# Altium schematic sheet MSPBreakout.SchDoc
size Letter
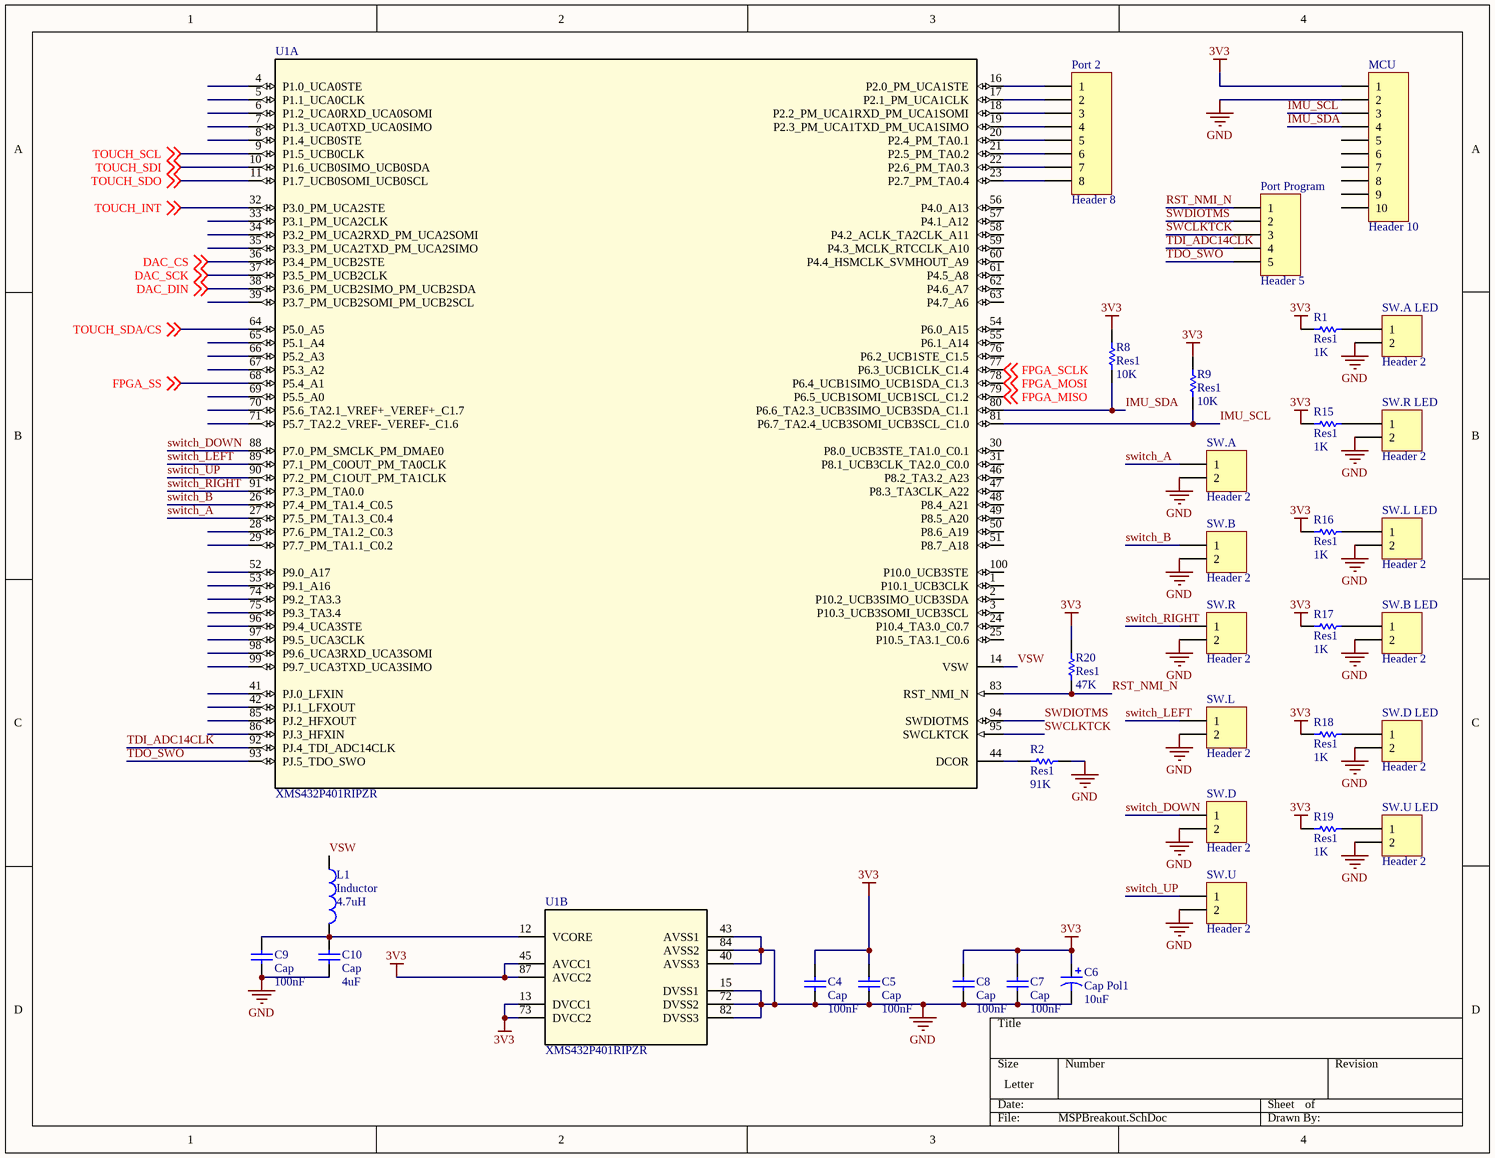
[diagram p0: MSPBreakout.SchDoc]

## Parts
C4  Cap  value 100nF  [6-0805_M]
C5  Cap  value 100nF  [6-0805_M]
C6  Cap Pol1  value 10uF  [6-0805_M]
C7  Cap  value 100nF  [6-0805_M]
C8  Cap  value 100nF  [6-0805_M]
C9  Cap  value 100nF  [6-0805_M]
C10  Cap  value 4uF  [6-0805_M]
L1  Inductor  value 4.7uH  [AXIAL-0.3]
MCU  Header 10  [HDR1X10]
Port_2  Header 8  [HDR1X8]
Port_Program  Header 5  [HDR1X5]
R1  Res1  value 1K  [6-0805_M]
R2  Res1  value 91K  [6-0805_M]
R8  Res1  value 10K  [6-0805_M]
R9  Res1  value 10K  [6-0805_M]
R15  Res1  value 1K  [6-0805_M]
R16  Res1  value 1K  [6-0805_M]
R17  Res1  value 1K  [6-0805_M]
R18  Res1  value 1K  [6-0805_M]
R19  Res1  value 1K  [6-0805_M]
R20  Res1  value 47K  [6-0805_M]
SW.A  Header 2  [HDR1X2]
SW.A_LED  Header 2  [HDR1X2]
SW.B  Header 2  [HDR1X2]
SW.B_LED  Header 2  [HDR1X2]
SW.D  Header 2  [HDR1X2]
SW.D_LED  Header 2  [HDR1X2]
SW.L  Header 2  [HDR1X2]
SW.L_LED  Header 2  [HDR1X2]
SW.R  Header 2  [HDR1X2]
SW.R_LED  Header 2  [HDR1X2]
SW.U  Header 2  [HDR1X2]
SW.U_LED  Header 2  [HDR1X2]
U1  XMS432P401RIPZR  [PZ0100A_M]  (parts A,B of 2)

## Nets
3V3: C4.2 C5.2 C6.1 C7.2 C8.2 MCU.1 R1.1 R8.2 R9.2 R15.1 R16.1 R17.1 R18.1 R19.1 R20.2 U1.13(DVCC1) U1.45(AVCC1) U1.73(DVCC2) U1.87(AVCC2)
GND: C4.1 C5.1 C6.2 C7.1 C8.1 C9.1 C10.1 MCU.2 R2.2 SW.A.2 SW.A_LED.2 SW.B.2 SW.B_LED.2 SW.D.2 SW.D_LED.2 SW.L.2 SW.L_LED.2 SW.R.2 SW.R_LED.2 SW.U.2 SW.U_LED.2 U1.15(DVSS1) U1.40(AVSS3) U1.43(AVSS1) U1.72(DVSS2) U1.82(DVSS3) U1.84(AVSS2)
DAC_CS: U1.36(P3.4_PM_UCB2STE) ; off-sheet DAC_CS
DAC_DIN: U1.38(P3.6_PM_UCB2SIMO_PM_UCB2SDA) ; off-sheet DAC_DIN
DAC_SCK: U1.37(P3.5_PM_UCB2CLK) ; off-sheet DAC_SCK
FPGA_MISO: U1.79(P6.5_UCB1SOMI_UCB1SCL_C1.2) ; off-sheet FPGA_MISO
FPGA_MOSI: U1.78(P6.4_UCB1SIMO_UCB1SDA_C1.3) ; off-sheet FPGA_MOSI
FPGA_SCLK: U1.77(P6.3_UCB1CLK_C1.4) ; off-sheet FPGA_SCLK
FPGA_SS: U1.68(P5.4_A1) ; off-sheet FPGA_SS
IMU_SCL: MCU.3 R9.1 U1.81(P6.7_TA2.4_UCB3SOMI_UCB3SCL_C1.0)
IMU_SDA: MCU.4 R8.1 U1.80(P6.6_TA2.3_UCB3SIMO_UCB3SDA_C1.1)
RST_NMI_N: Port_Program.1 R20.1 U1.83(RST_NMI_N)
SWCLKTCK: Port_Program.3 U1.95(SWCLKTCK)
SWDIOTMS: Port_Program.2 U1.94(SWDIOTMS)
switch_A: SW.A.1 U1.27(P7.5_PM_TA1.3_C0.4)
switch_B: SW.B.1 U1.26(P7.4_PM_TA1.4_C0.5)
switch_DOWN: SW.D.1 U1.88(P7.0_PM_SMCLK_PM_DMAE0)
switch_LEFT: SW.L.1 U1.89(P7.1_PM_C0OUT_PM_TA0CLK)
switch_RIGHT: SW.R.1 U1.91(P7.3_PM_TA0.0)
switch_UP: SW.U.1 U1.90(P7.2_PM_C1OUT_PM_TA1CLK)
TDI_ADC14CLK: Port_Program.4 U1.92(PJ.4_TDI_ADC14CLK)
TDO_SWO: Port_Program.5 U1.93(PJ.5_TDO_SWO)
TOUCH_INT: U1.32(P3.0_PM_UCA2STE) ; off-sheet TOUCH_INT
TOUCH_SCL: U1.9(P1.5_UCB0CLK) ; off-sheet TOUCH_SCL
TOUCH_SDA/CS: U1.64(P5.0_A5) ; off-sheet TOUCH_SDA/CS
TOUCH_SDI: U1.10(P1.6_UCB0SIMO_UCB0SDA) ; off-sheet TOUCH_SDI
TOUCH_SDO: U1.11(P1.7_UCB0SOMI_UCB0SCL) ; off-sheet TOUCH_SDO
VSW: L1.1 U1.14(VSW)
NetC9_2: C9.2 C10.2 L1.2 U1.12(VCORE)
NetPort_2_1: Port_2.1 U1.16(P2.0_PM_UCA1STE)
NetPort_2_2: Port_2.2 U1.17(P2.1_PM_UCA1CLK)
NetPort_2_3: Port_2.3 U1.18(P2.2_PM_UCA1RXD_PM_UCA1SOMI)
NetPort_2_4: Port_2.4 U1.19(P2.3_PM_UCA1TXD_PM_UCA1SIMO)
NetPort_2_5: Port_2.5 U1.20(P2.4_PM_TA0.1)
NetPort_2_6: Port_2.6 U1.21(P2.5_PM_TA0.2)
NetPort_2_7: Port_2.7 U1.22(P2.6_PM_TA0.3)
NetPort_2_8: Port_2.8 U1.23(P2.7_PM_TA0.4)
NetR1_2: R1.2 SW.A_LED.1
NetR2_1: R2.1 U1.44(DCOR)
NetR15_2: R15.2 SW.R_LED.1
NetR16_2: R16.2 SW.L_LED.1
NetR17_2: R17.2 SW.B_LED.1
NetR18_2: R18.2 SW.D_LED.1
NetR19_2: R19.2 SW.U_LED.1

Not connected (* = marked no-connect by the designer): MCU 5 6 7 8 9 10; U1 1(P10.1_UCB3CLK) 2(P10.2_UCB3SIMO_UCB3SDA) 3(P10.3_UCB3SOMI_UCB3SCL) 4(P1.0_UCA0STE) 5(P1.1_UCA0CLK) 6(P1.2_UCA0RXD_UCA0SOMI) 7(P1.3_UCA0TXD_UCA0SIMO) 8(P1.4_UCB0STE) 24(P10.4_TA3.0_C0.7) 25(P10.5_TA3.1_C0.6) 28(P7.6_PM_TA1.2_C0.3) 29(P7.7_PM_TA1.1_C0.2) 30(P8.0_UCB3STE_TA1.0_C0.1) 31(P8.1_UCB3CLK_TA2.0_C0.0) 33(P3.1_PM_UCA2CLK) 34(P3.2_PM_UCA2RXD_PM_UCA2SOMI) 35(P3.3_PM_UCA2TXD_PM_UCA2SIMO) 39(P3.7_PM_UCB2SOMI_PM_UCB2SCL) 41(PJ.0_LFXIN) 42(PJ.1_LFXOUT) 46(P8.2_TA3.2_A23) 47(P8.3_TA3CLK_A22) 48(P8.4_A21) 49(P8.5_A20) 50(P8.6_A19) 51(P8.7_A18) 52(P9.0_A17) 53(P9.1_A16) 54(P6.0_A15) 55(P6.1_A14) 56(P4.0_A13) 57(P4.1_A12) 58(P4.2_ACLK_TA2CLK_A11) 59(P4.3_MCLK_RTCCLK_A10) 60(P4.4_HSMCLK_SVMHOUT_A9) 61(P4.5_A8) 62(P4.6_A7) 63(P4.7_A6) 65(P5.1_A4) 66(P5.2_A3) 67(P5.3_A2) 69(P5.5_A0) 70(P5.6_TA2.1_VREF+_VEREF+_C1.7) 71(P5.7_TA2.2_VREF-_VEREF-_C1.6) 74(P9.2_TA3.3) 75(P9.3_TA3.4) 76(P6.2_UCB1STE_C1.5) 85(PJ.2_HFXOUT) 86(PJ.3_HFXIN) 96(P9.4_UCA3STE) 97(P9.5_UCA3CLK) 98(P9.6_UCA3RXD_UCA3SOMI) 99(P9.7_UCA3TXD_UCA3SIMO) 100(P10.0_UCB3STE)

## Library data of the parts
C4 C5 C7-C10 = Cap: Capacitor; Published: 8-Jun-2000; LatestRevisionDate: 17-Jul-2002; LatestRevisionNote: Re-released for DXP Platform.; PackageReference: RAD-0.3; Publisher: Altium Limited; PackageDescription: Radial Cap, Thru-Hole; 2 Leads; 0.3 in Pin Spacing
C6 = Cap Pol1: Polarized Capacitor (Radial); Published: 8-Jun-2000; LatestRevisionDate: 17-Jul-2002; LatestRevisionNote: Re-released for DXP Platform.; PackageReference: RB7.6-15; Publisher: Altium Limited; PackageDescription: Polarized Capacitor (Radial); 2 Leads
L1 = Inductor: Code_IEC: 1005; Published: 8-Jun-2000; LatestRevisionDate: 29-May-2009; LatestRevisionNote: IPC-7351 Footprint Added.; PackageReference: 0402-A; Publisher: Altium Limited; PackageDescription: Chip Inductor; Code_JEITA: 0402
MCU = Header 10: Header, 10-Pin; LatestRevisionDate: 17-Jul-2002; LatestRevisionNote: Re-released for DXP Platform.; Publisher: Altium Limited
Port_2 = Header 8: Header, 8-Pin; LatestRevisionDate: 17-Jul-2002; LatestRevisionNote: Re-released for DXP Platform.; Publisher: Altium Limited
Port_Program = Header 5: Header, 5-Pin; LatestRevisionDate: 17-Jul-2002; LatestRevisionNote: Re-released for DXP Platform.; Publisher: Altium Limited
R1 R2 R8 R9 R15-R20 = Res1: Resistor; Published: 8-Jun-2000; LatestRevisionDate: 17-Jul-2002; LatestRevisionNote: Re-released for DXP Platform.; PackageReference: AXIAL-0.3; Publisher: Altium Limited; PackageDescription: Axial Device, Thru-Hole; 2 Leads; 0.3 in Pin Spacing
SW.A SW.A_LED SW.B SW.B_LED SW.D SW.D_LED SW.L SW.L_LED SW.R SW.R_LED SW.U SW.U_LED = Header 2: Header, 2-Pin; LatestRevisionDate: 17-Jul-2002; LatestRevisionNote: Re-released for DXP Platform.; Publisher: Altium Limited
U1 = XMS432P401RIPZR: Imported; Manufacturer: Texas Instruments; CompType: IC; PIN_COUNT: 100; PartNumber: XMS432P401RIPZR; PackageReference: PZ0100A; MountType: SMT; RefDes: RefDes; TYPE: TYPE; Value: Value